# EAGLE design DRV8711 BOARD (EAGLE 9.4.2)

## Sheet 1 of 2

## Sheet 2 of 2
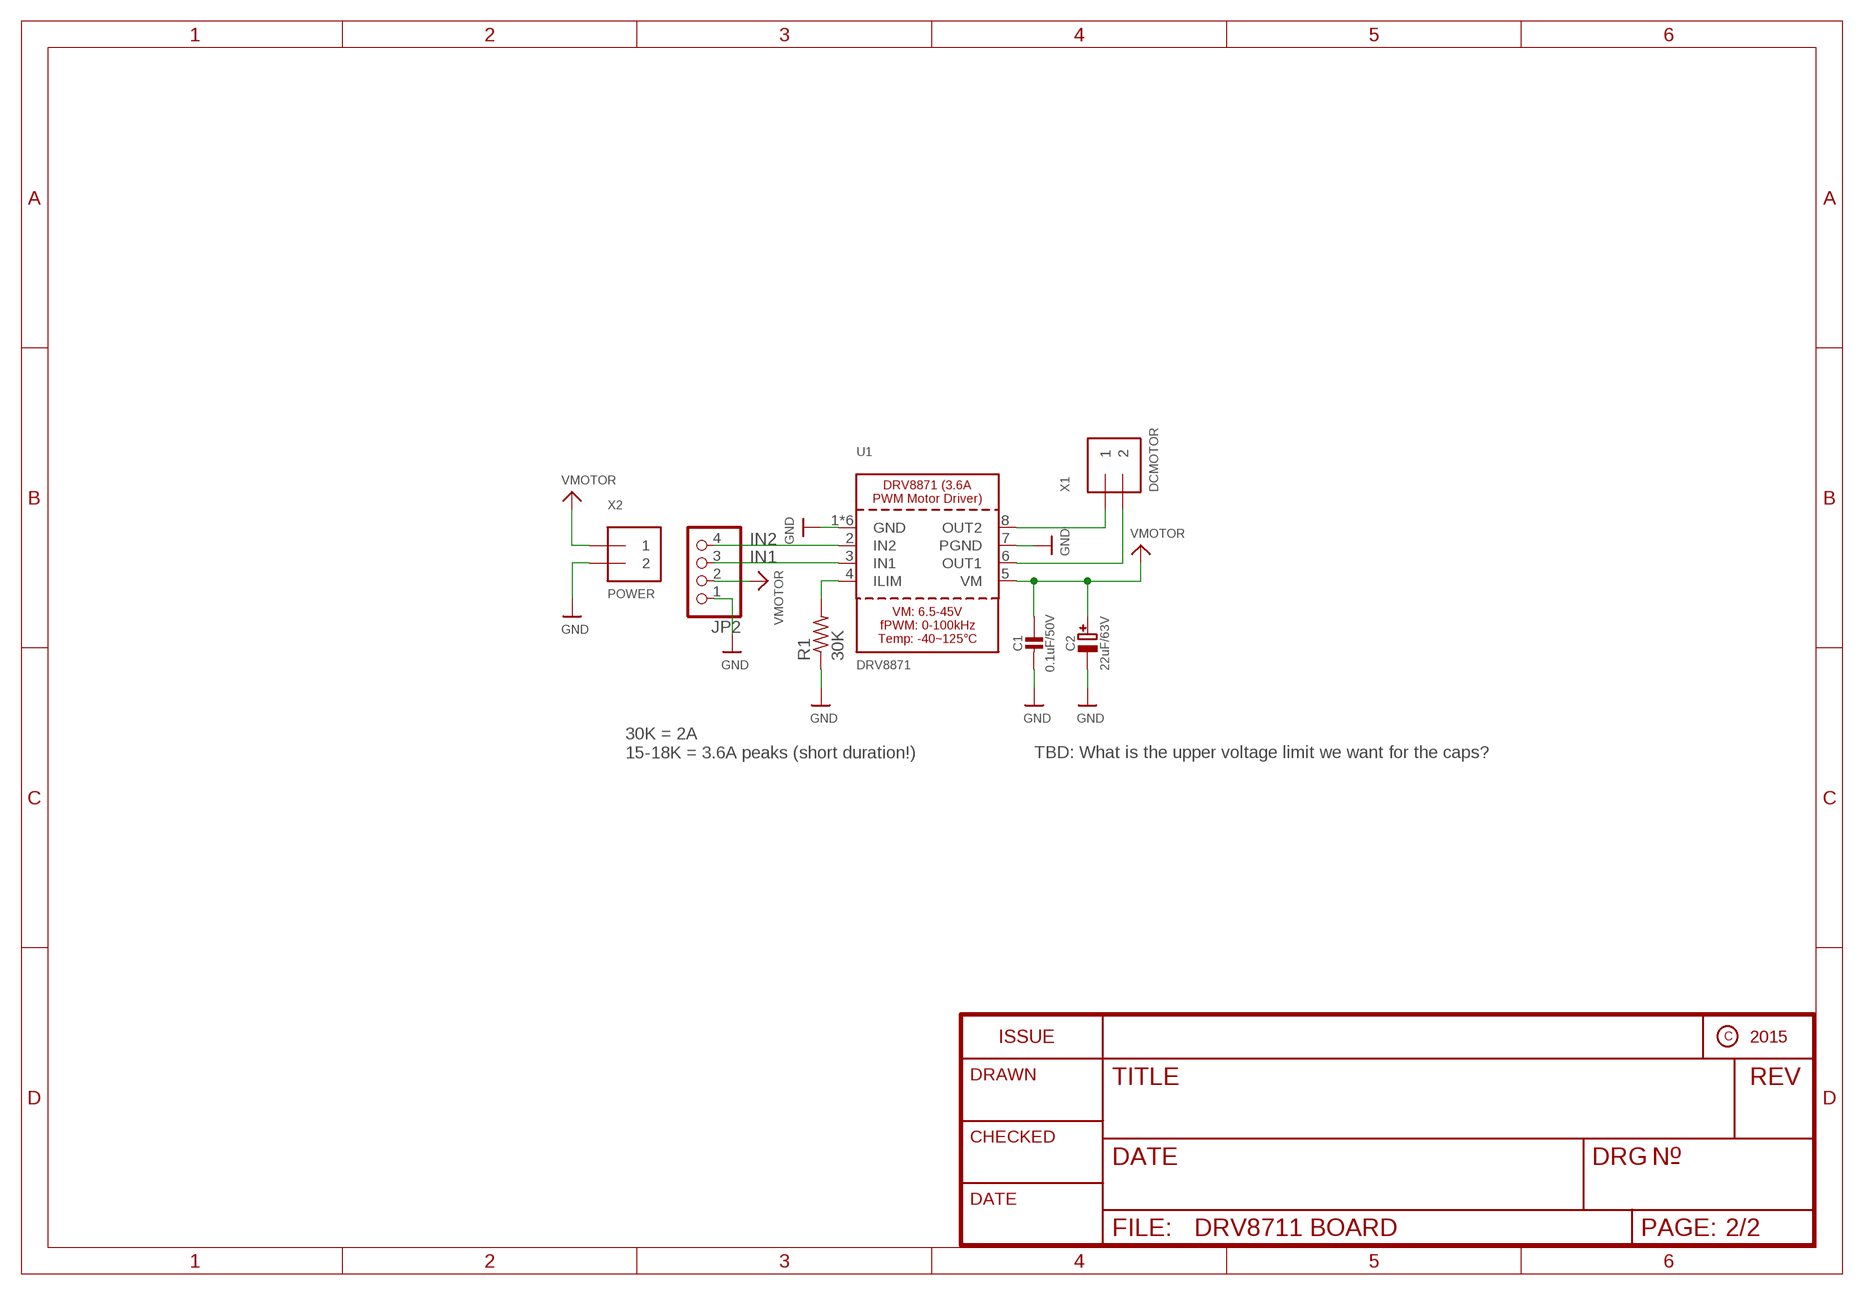
[diagram p0: schematic, sheet 2]

### Parts
C1  0.1uF/50V  CAP_CERAMIC0805-NOOUTLINE  [0805-NO]
C2  22uF/63V  CAP_ELECTROLYTICPTH_3.5MMGRID_10MMDIA  [CELEC_3.5MM_10MM]
JP2  HEADER-1X476MIL  [1X04_ROUND_76]
R1  30K  FLIPFLOP-RES  [0805-THM]
U1  DRV8871  [HSOP8]
X1  DCMOTOR  TERMBLOCK_1X2  [TERMBLOCK_1X2-3.5MM]
X2  POWER  TERMBLOCK_1X2  [TERMBLOCK_1X2-3.5MM]

### Nets
GND: C1.2 C2.- JP2.1 R1.1 U1.1(GND) U1.7(PGND) U1.GND U1.P$1(GND) U1.P$2(GND) U1.P$3(GND) U1.P$4(GND) X2.2
IN1: JP2.3 U1.3(IN1)
IN2: JP2.4 U1.2(IN2)
N$1: R1.2 U1.4(ILIM)
OUT1: U1.6(OUT1) X1.2
OUT2: U1.8(OUT2) X1.1
VMOTOR: C1.1 C2.+ JP2.2 U1.5(VM) X2.1

### Notes on the sheet
- 30K = 2A
  15-18K = 3.6A peaks (short duration!)
- TBD: What is the upper voltage limit we want for the caps?

## Library data of the parts
C1 = microbuilder:CAP_CERAMIC: Ceramic Capacitors For new designs, use the packages preceded by an '_' character since they are more reliable: The following footprints should be used on most boards: _0402 - Standard footprint for regular board layouts _0603 - Standard footprint for regular board layouts _0805 - Standard footprint for regular board layouts _1206 - Standard footprint for regular board layouts For extremely tight-pitch boards where space is at a premium, the following 'micro-pitch' footprints can be used (smaller pads, no silkscreen outline, etc.): _0402MP - Micro-pitch footprint for very dense/compact boards _0603MP - Micro-pitch footprint for very dense/compact boards _0805MP - Micro-pitch footprint for very dense/compact boards _1206MP - Micro-pitch footprint for very dense/compact boards
C2 = microbuilder:CAP_ELECTROLYTIC: Electrolytic Capacitors SMT PANASONIC_C - Size C Panasonic Electrolytic Aluminum Capacitor 47µF 16V 20% Electrolytic Capacitor [Digikey: PCE3890TR-ND] PANASONIC_D - Size D Panasonic Electrolytic Aluminum Capacitor 100µF 25V 20% Electrolytic Capacitor [Digikey: PCE3898TR-ND] PTH 3.5 mm grid, 8 mm diameter ... 3.5 mm grid, 10 mm diameter ...
JP2 = microbuilder:HEADER-1X4: PIN HEADER
R1 = adafruit:FLIPFLOP-RES: Flip Flop resistor An 0805 resistor inside a standard 1/4W 5% resistor. Makes for easy mods
U1 = microbuilder:DRV8871: DRV8871 - 3.6A PWM Motor Driver
X1 X2 = microbuilder:TERMBLOCK_1X2: 3.5mm Terminal block http://www.ladyada.net/library/pcb/eaglelibrary.html

## Board
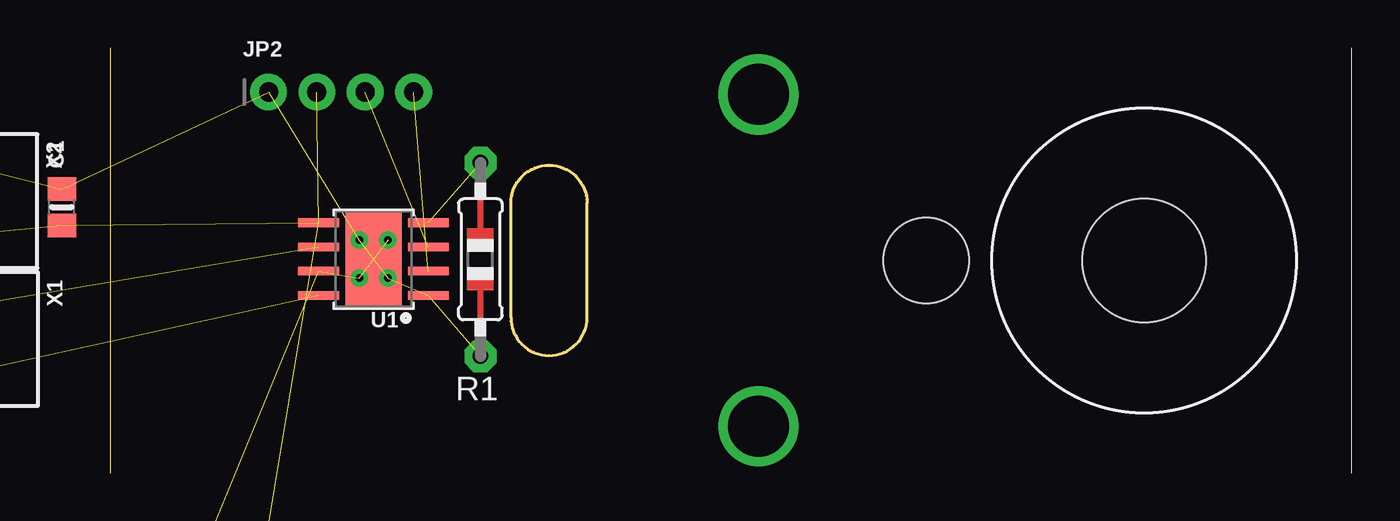
[diagram p1: board, top side]
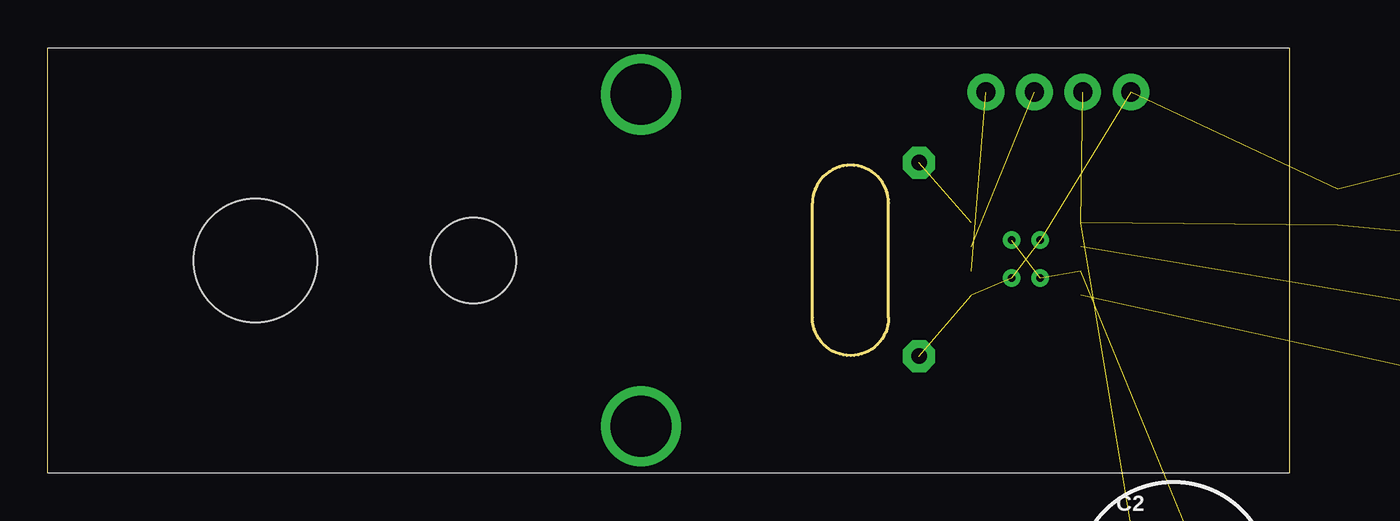
[diagram p2: board, bottom side, seen from below]

Size 65.21 x 22.34 mm. Coordinates in mm from the lower left corner, seen from the top.
Outline: 65.21,0 65.21,22.34
Outline: 0,22.34 0,0
Outline: 25.04,8.17 25.04,14.17 arc180 21.04,14.17 21.04,8.17 arc180 25.04,8.17
Copper layers (1*16): Top 0.035mm / dielectric 1.5mm / Bottom 0.035mm
Design rules "default": minimum track width 6mil, minimum drill 0.35mm, track to track 6mil, track to pad 6mil, pad to pad 6mil, via to via 6mil, smd to smd 6mil, copper to edge 40mil, drill to drill 6mil, minimum pad ring 10mil, minimum via ring 8mil, stop-mask expansion 4mil, vias tented up to drill 0mil, thermal gap 10mil
Holes 4.5 mm at 42.86,11.17
Holes 6.5 mm at 54.29,11.17

### Footprints (pad centres in the part's own frame; a part is rotated, then mirrored left to right if it is on the bottom)
0805-NO = smd 1.24 x 1.5: 1 -0.95,0; 2 0.95,0
CELEC_3.5MM_10MM = drill 0.813 pad 1.6: + -1.778,0 | drill 0.813 pad 1.6 octagon: - 1.778,0
1X04_ROUND_76 = drill 1 pad 1.93: 1 -3.81,0; 2 -1.27,0; 3 1.27,0; 4 3.81,0
0805-THM = drill 0.813 pad 1.676 octagon: 1 -5.08,0; 2 5.08,0
HSOP8 = smd 0.45 x 2.15: 1 -1.905,-2.875; 2 -0.635,-2.875; 3 0.635,-2.875; 4 1.905,-2.875; 5 1.905,2.875; 6 0.635,2.875; 7 -0.635,2.875; 8 -1.905,2.875 | smd 4.9 x 2.95: GND 0,0 | drill 0.4: P$1 -1,0.75; P$2 -1,-0.75; P$3 1,-0.75; P$4 1,0.75
TERMBLOCK_1X2-3.5MM = drill 1 pad 2.184: 1 1.8,0; 2 -1.7,0

### Placement (x,y rotation side)
C1  -2.54,13.96 90 top
C2  6.08,-5.55 0 bottom  (outside the outline)
JP2  12.12,20.01 0 top
R1  19.44,11.22 90 top
U1  13.83,11.24 90 top
X1  -7.19,7.14 270 top  (outside the outline)
X2  -7.23,14.38 270 top  (outside the outline)

### Tracks (layer width: path | path; a pad name or v marks a point on that pad's centre or on a via)
GND  (11 unrouted)
IN1  (1 unrouted)
IN2  (1 unrouted)
N$1  (1 unrouted)
N$2  (via drill 3.2)
  other vias: 34.04,19.88
N$3  (via drill 3.2)
  other vias: 34.04,2.46
OUT1  (1 unrouted)
OUT2  (1 unrouted)
VMOTOR  (4 unrouted)